# Altium schematic sheet FEU-102-1_part4.SchDoc: Делитель ФЭУ-82
size A3; Address1: (с) Быканов Андрей; Address2: г.Тула 2016г.; Revision: 1
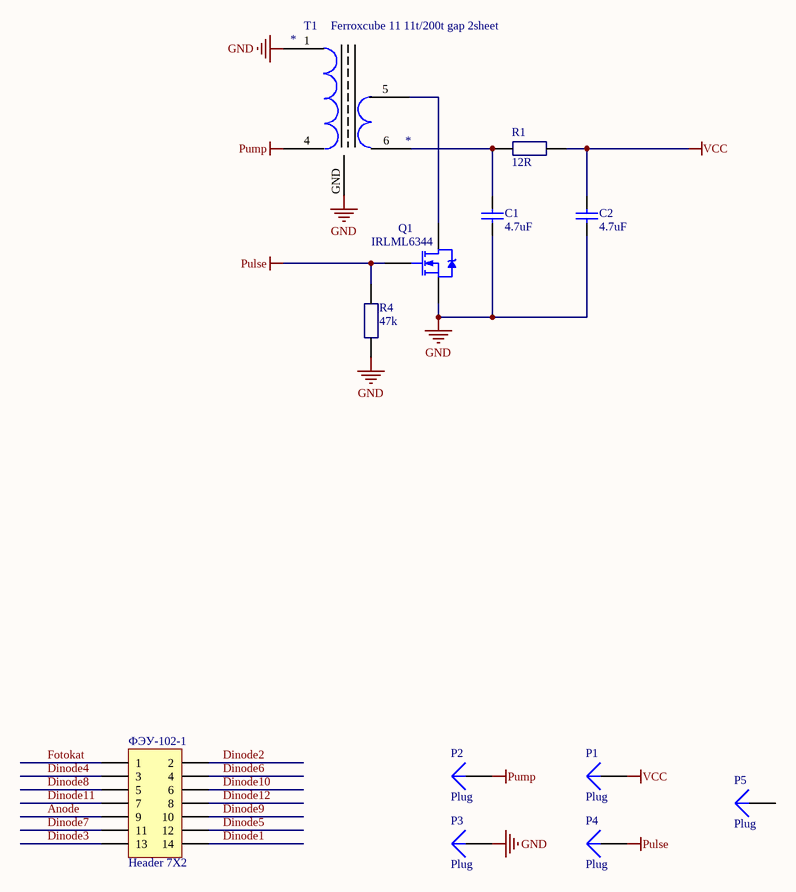
[diagram p0: FEU-102-1_part4.SchDoc]

## Parts
C1  4.7uF  [C1206]
C2  4.7uF  [C1206]
P1  Plug  [PIN1]
P2  Plug  [PIN1]
P3  Plug  [PIN1]
P4  Plug  [PIN1]
P5  Plug  [PIN1]
Q1  IRLML6344  [SOT-23_N]
R1  12R  [1608[0603]_RES]
R4  47k  [1608[0603]_RES]
T1  Ferroxcube 11 11t/200t gap 2sheet  [Epcos ER9.5/5]
ФЭУ-102-1  Header 7X2  [ФЭУ-102]

## Nets
GND: C1.2 C2.2 P3.1 Q1.2(S) R4.1(A) T1.1 T1.GND
Pulse: P4.1 Q1.1(G) R4.2
Pump: P2.1 T1.4
VCC: C2.1 P1.1 R1.2
Anode: ФЭУ-102-1.9
Dinode1: ФЭУ-102-1.14
Dinode2: ФЭУ-102-1.2
Dinode3: ФЭУ-102-1.13
Dinode4: ФЭУ-102-1.3
Dinode5: ФЭУ-102-1.12
Dinode6: ФЭУ-102-1.4
Dinode7: ФЭУ-102-1.11
Dinode8: ФЭУ-102-1.5
Dinode9: ФЭУ-102-1.10
Dinode10: ФЭУ-102-1.6
Dinode11: ФЭУ-102-1.7
Dinode12: ФЭУ-102-1.8
Fotokat: ФЭУ-102-1.1
NetC1_1: C1.1 R1.1(A) T1.6
NetQ1_3: Q1.3(D) T1.5

Not connected (* = marked no-connect by the designer): P5 1

## Notes on the sheet
- Title
- Size:
- Date:
- A3
- Number:
- Time:
- Revision:
- Sheet
- of
- File:

## Library data of the parts
C1 C2 = Cap Semi: Capacitor (Semiconductor SIM Model); Order: CC1206KKX7R8BB475; Published: 8-Jun-2000; LatestRevisionDate: 29-May-2009; LatestRevisionNote: IPC-7351 Footprint Added.; PackageReference: C1206; Publisher: Altium Limited; PackageDescription: Chip Capacitor; Value: 4.7uF
Q1 = IRLML2402: HEXFET Power MOSFET; Published: 8-Jun-2000; LatestRevisionDate: 20-Nov-2009; LatestRevisionNote: IPC-7351 Footprint Added.; DatasheetVersion: Aug-1997; PackageReference: SOT-23; Publisher: Altium Limited; PackageDescription: 3-Pin SOT-23 Package 0.95 mm Pitch, 2.3 mm Lead Span; ComponentLink1Description: Manufacturer Link; ComponentLink1URL: http://www.irf.com/; ComponentLink2Description: Datasheet; ComponentLink2URL: http://www.irf.com/product-info/datasheets/data/irlml2402.pdf; Order: IRLML6344
R1 = Resistor 0805: Order: ERJ3GEYJ120V; Avail: 20; Value: 12R
R4 = Resistor 0805: Order: RC0603FR-0747KL; Avail: 20; Value: 47k
T1 = Epcos ER9.5/5: Order: Ferroxcube 11 11t/200t gap 2sheet
ФЭУ-102-1 = Header 7X2: Header, 7-Pin, Dual row; LatestRevisionDate: 17-Jul-2002; LatestRevisionNote: Re-released for DXP Platform.; Publisher: Altium Limited
P1-P5 = Plug: LatestRevisionDate: 17-Jul-2002; LatestRevisionNote: Re-released for DXP Platform.; Publisher: Altium Limited